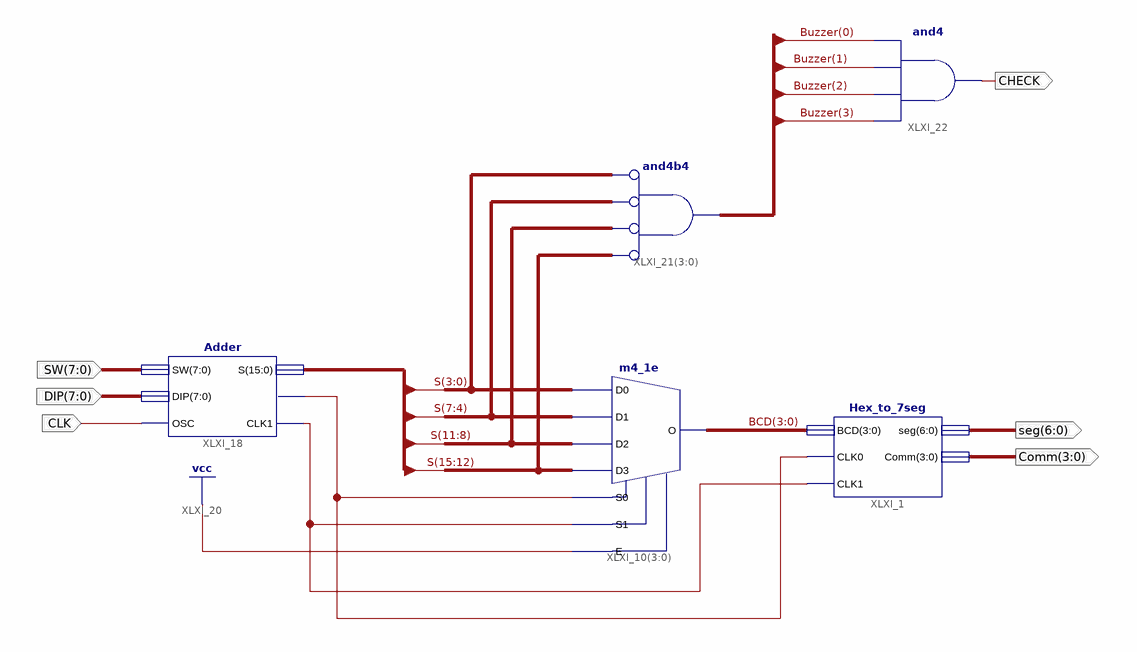
[diagram p0: schematic sheet 1]
// Xilinx ISE schematic Adder8bit.sch (spartan6) as structural Verilog: 5 symbols, 6 ports
module Adder8bit (
  input  [7:0] SW,
  input  [7:0] DIP,
  input  CLK,
  output [6:0] seg,
  output [3:0] Comm,
  output CHECK
);

  wire XLXN_29, XLXN_30;
  wire [3:0] BCD, Buzzer;
  wire [15:0] S;

  m4_1e XLXI_10[3:0] (
    .D0(S[3:0]), .D1(S[7:4]), .D2(S[11:8]), .D3(S[15:12]), .E(1'b1), .S0(XLXN_29), .S1(XLXN_30), .O(BCD));
  Adder XLXI_18 (.SW(SW), .DIP(DIP), .OSC(CLK), .S(S), .CLK0(XLXN_29), .CLK1(XLXN_30));
  Hex_to_7seg XLXI_1 (.BCD(BCD), .seg(seg), .Comm(Comm), .CLK0(XLXN_29), .CLK1(XLXN_30));
  assign Buzzer = ~S[15:12] & ~S[11:8] & ~S[7:4] & ~S[3:0];  // and4b4 XLXI_21[3..0], 4 bits wide
  and XLXI_22 (CHECK, Buzzer[3], Buzzer[2], Buzzer[1], Buzzer[0]);

  // Notes on the sheet:
  //   LOC on signal SW(7:0) = P55,P56,P57,P58,P59,P61,P62,P66
  //   LOC on signal DIP(7:0) = P112,P111,P105,P104,P102,P101,P100,P99
  //   LOC on signal CLK = P123
  //   LOC on signal seg(6:0) = P27,P29,P32,P34,P35,P40,P41
  //   LOC on signal Comm(3:0) = P30,P33,P43,P44
  //   LOC on signal CHECK = P83
endmodule
